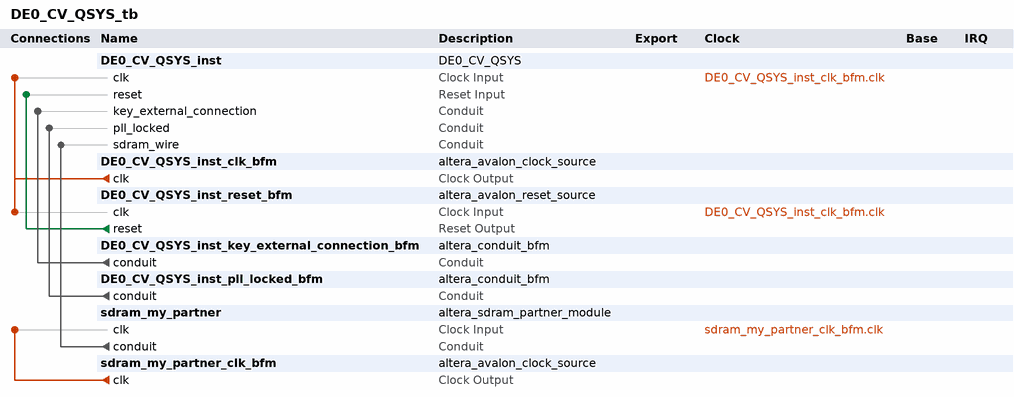
[diagram p0: system contents]
# Platform Designer (Qsys) system DE0_CV_QSYS_tb, Cyclone V 5CEBA4F23C7
# Parameters at their usual value, and those the tool derives, are not listed.
package require -exact qsys 18.1
create_system DE0_CV_QSYS_tb
set_project_property DEVICE_FAMILY {Cyclone V}
set_project_property DEVICE 5CEBA4F23C7

add_instance DE0_CV_QSYS_inst DE0_CV_QSYS 1.0

add_instance DE0_CV_QSYS_inst_clk_bfm altera_avalon_clock_source 18.1

add_instance DE0_CV_QSYS_inst_reset_bfm altera_avalon_reset_source 18.1
set_instance_parameter_value DE0_CV_QSYS_inst_reset_bfm ASSERT_HIGH_RESET 0
set_instance_parameter_value DE0_CV_QSYS_inst_reset_bfm INITIAL_RESET_CYCLES 50

add_instance DE0_CV_QSYS_inst_key_external_connection_bfm altera_conduit_bfm 18.1
set_instance_parameter_value DE0_CV_QSYS_inst_key_external_connection_bfm CLOCKED_SIGNAL false
set_instance_parameter_value DE0_CV_QSYS_inst_key_external_connection_bfm ENABLE_RESET false
set_instance_parameter_value DE0_CV_QSYS_inst_key_external_connection_bfm SIGNAL_DIRECTIONS output
set_instance_parameter_value DE0_CV_QSYS_inst_key_external_connection_bfm SIGNAL_WIDTHS 4

add_instance DE0_CV_QSYS_inst_pll_locked_bfm altera_conduit_bfm 18.1
set_instance_parameter_value DE0_CV_QSYS_inst_pll_locked_bfm CLOCKED_SIGNAL false
set_instance_parameter_value DE0_CV_QSYS_inst_pll_locked_bfm ENABLE_RESET false
set_instance_parameter_value DE0_CV_QSYS_inst_pll_locked_bfm SIGNAL_DIRECTIONS input
set_instance_parameter_value DE0_CV_QSYS_inst_pll_locked_bfm SIGNAL_WIDTHS 1

add_instance sdram_my_partner altera_sdram_partner_module 11.0
set_instance_parameter_value sdram_my_partner CONTR_NAME DE0_CV_QSYS_sdram
set_instance_parameter_value sdram_my_partner SDRAM_COL_WIDTH 10
set_instance_parameter_value sdram_my_partner SDRAM_DATA_WIDTH 16
set_instance_parameter_value sdram_my_partner SDRAM_ROW_WIDTH 13

add_instance sdram_my_partner_clk_bfm altera_avalon_clock_source 18.1
set_instance_parameter_value sdram_my_partner_clk_bfm CLOCK_RATE 143000000

# connections
add_connection DE0_CV_QSYS_inst_clk_bfm.clk DE0_CV_QSYS_inst.clk clock
add_connection DE0_CV_QSYS_inst_clk_bfm.clk DE0_CV_QSYS_inst_reset_bfm.clk clock
add_connection sdram_my_partner_clk_bfm.clk sdram_my_partner.clk clock
add_connection DE0_CV_QSYS_inst_reset_bfm.reset DE0_CV_QSYS_inst.reset reset
add_connection DE0_CV_QSYS_inst_key_external_connection_bfm.conduit DE0_CV_QSYS_inst.key_external_connection conduit
add_connection DE0_CV_QSYS_inst_pll_locked_bfm.conduit DE0_CV_QSYS_inst.pll_locked conduit
add_connection sdram_my_partner.conduit DE0_CV_QSYS_inst.sdram_wire conduit

set_interconnect_requirement {$system} qsys_mm.clockCrossingAdapter HANDSHAKE
set_interconnect_requirement {$system} qsys_mm.enableEccProtection FALSE
set_interconnect_requirement {$system} qsys_mm.insertDefaultSlave FALSE
set_interconnect_requirement {$system} qsys_mm.maxAdditionalLatency 1

save_system DE0_CV_QSYS_tb.qsys
